# EAGLE design GyroCam BNO055_v2 (EAGLE 9.6.2)
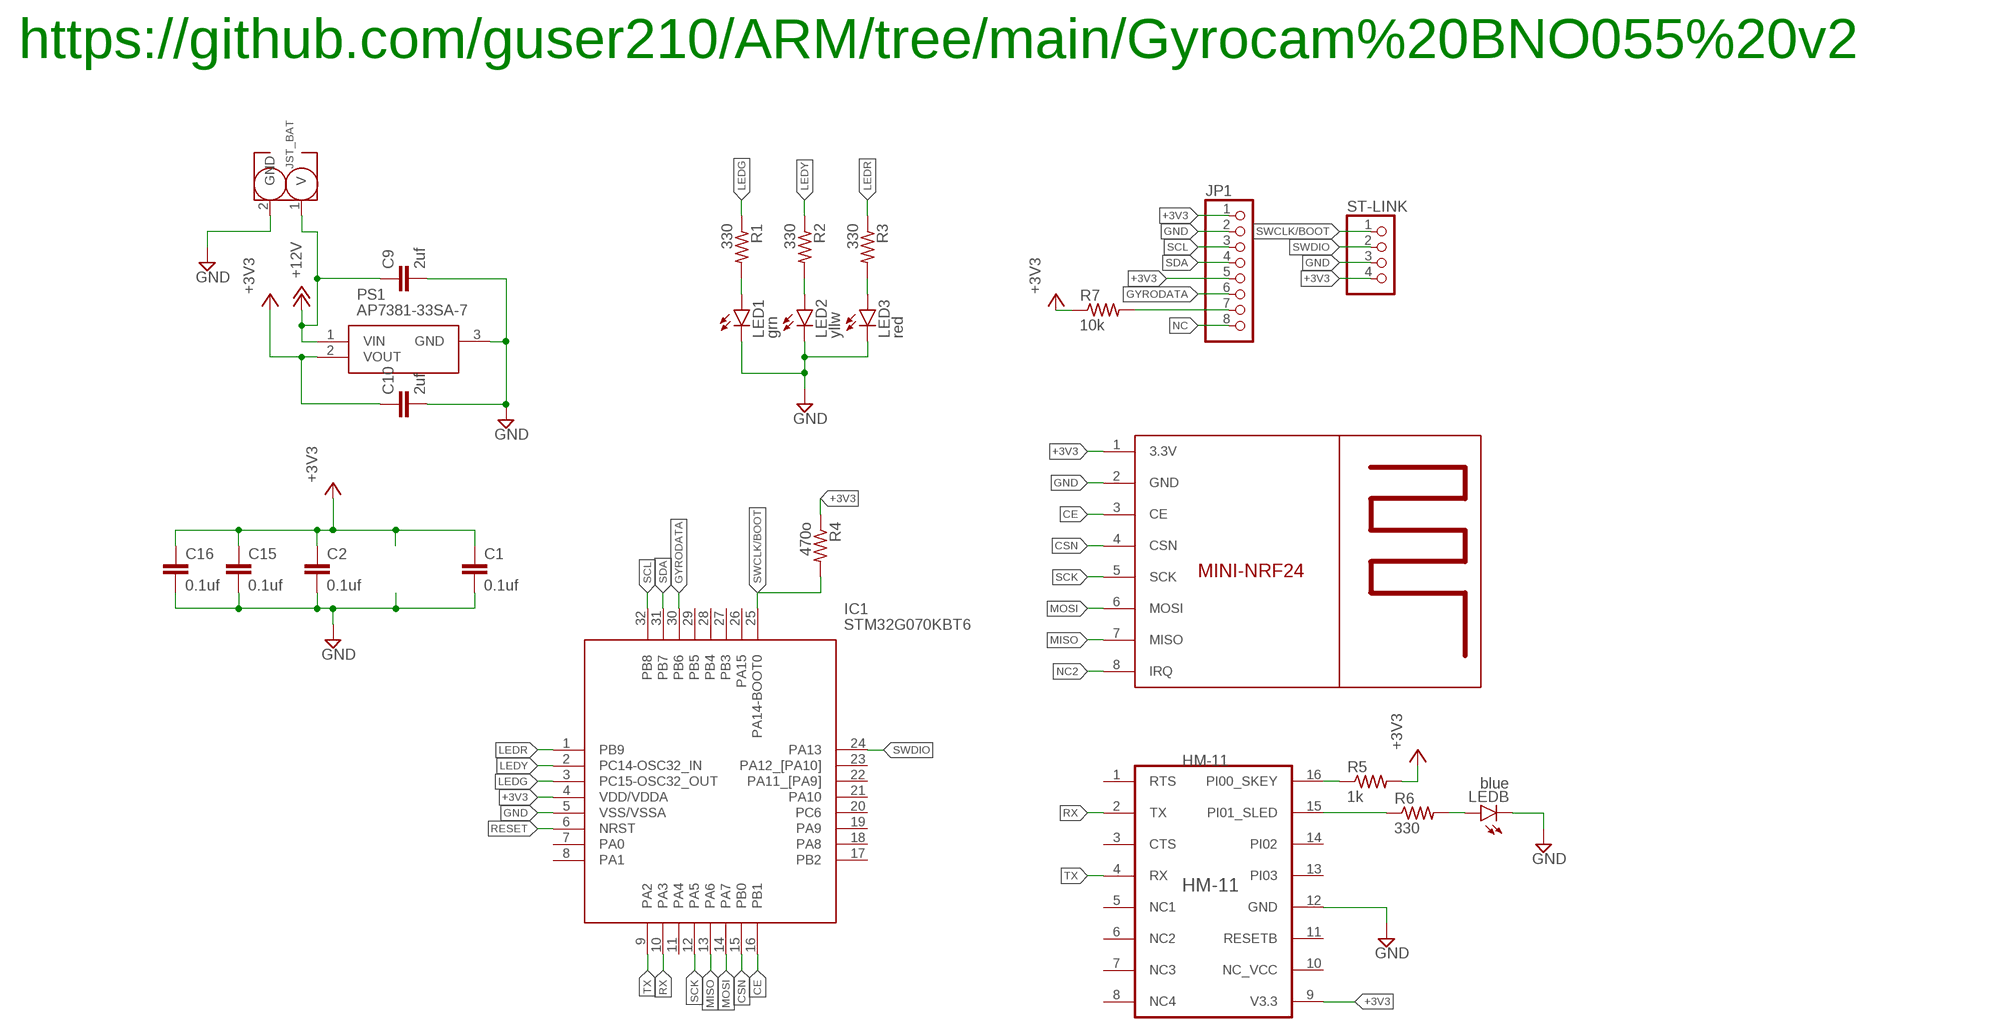
[diagram p0: schematic, sheet 1]

## Parts
C1  0.1uf  C-EUC0603K  [C0603K]
C2  0.1uf  C-EUC0805K  [C0805K]
C9  2uf  C-EUC0805K  [C0805K]
C10  2uf  C-EUC0805K  [C0805K]
C15  0.1uf  C-EUC0805K  [C0805K]
C16  0.1uf  C-EUC0805K  [C0805K]
IC1  STM32G070KBT6  [QFP80P900X900X160-32N]
JP1  PINHD-1X8  [1X08]
LED1  grn  LEDSML0805  [SML0805]
LED2  yllw  LEDSML0805  [SML0805]
LED3  red  LEDSML0805  [SML0805]
LEDB  blue  LEDSML0805  [SML0805]
PS1  AP7381-33SA-7  [SOT96P240X120-3N]
R1  330  R-US_M0805  [M0805]
R2  330  R-US_M0805  [M0805]
R3  330  R-US_M0805  [M0805]
R4  470o  R-US_M0805  [M0805]
R5  1k  R-US_M0805  [M0805]
R6  330  R-US_M0805  [M0805]
R7  10k  R-US_M0805  [M0805]
ST-LINK  PINHD-1X4  [1X04]
SUPP  JST2.0MM_2PIN  [JST2.0MM_2PIN]
U$1  HM-11  [HM-11]
U$3  NRF24  MINI-NRF24L01PSMD  [NRF24L01_SMD]

## Nets
+3V3: C1.1 C2.1 C10.1 C15.1 C16.1 IC1.4(VDD/VDDA) JP1.1 JP1.5 PS1.2(VOUT) R4.1 R5.2 R7.1 ST-LINK.4 U$1.9(V3.3) U$3.1(3.3V)
+12V: C9.1 PS1.1(VIN) SUPP.1(V)
BOOT: JP1.7 R7.2
CE: IC1.16(PB1) U$3.3(CE)
CSN: IC1.15(PB0) U$3.4(CSN)
GND: C1.2 C2.2 C9.2 C10.2 C15.2 C16.2 IC1.5(VSS/VSSA) JP1.2 LED1.C LED2.C LED3.C LEDB.C PS1.3(GND) ST-LINK.3 SUPP.2(GND) U$1.12(GND) U$3.2(GND)
GYRODATA: IC1.30(PB6) JP1.6
LEDG: IC1.3(PC15-OSC32_OUT) R1.1
LEDR: IC1.1(PB9) R3.1
LEDY: IC1.2(PC14-OSC32_IN) R2.1
MISO: IC1.13(PA6) U$3.7(MISO)
MOSI: IC1.14(PA7) U$3.6(MOSI)
N$2: LED2.A R2.2
N$3: LED1.A R1.2
N$4: LED3.A R3.2
N$5: R5.1 U$1.16(PI00_SKEY)
N$6: R6.1 U$1.15(PI01_SLED)
N$7: LEDB.A R6.2
NC: JP1.8
NC2: U$3.8(IRQ)
RESET: IC1.6(NRST)
RX: IC1.10(PA3) U$1.2(TX)
SCK: IC1.12(PA5) U$3.5(SCK)
SCL: IC1.32(PB8) JP1.3
SDA: IC1.31(PB7) JP1.4
SWCLK/BOOT: IC1.25(PA14-BOOT0) R4.2 ST-LINK.1
SWDIO: IC1.24(PA13) ST-LINK.2
TX: IC1.9(PA2) U$1.4(RX)
Unconnected: IC1.7(PA0) IC1.8(PA1) IC1.11(PA4) IC1.17(PB2) IC1.18(PA8) IC1.19(PA9) IC1.20(PC6) IC1.21(PA10) IC1.22(PA11_[PA9]) IC1.23(PA12_[PA10]) IC1.26(PA15) IC1.27(PB3) IC1.28(PB4) IC1.29(PB5) U$1.1(RTS) U$1.3(CTS) U$1.5(NC1) U$1.6(NC2) U$1.7(NC3) U$1.8(NC4) U$1.10(NC_VCC) U$1.11(RESETB) U$1.13(PI03) U$1.14(PI02)

## Notes on the sheet
- https://github.com/guser210/ARM/tree/main/Gyrocam%20BNO055%20v2

## Library data of the parts
C1 C2 C9 C10 C15 C16 = rcl:C-EU: CAPACITOR, European symbol; SPICEPREFIX: C
IC1 = STM32G070KBT6:STM32G070KBT6: 32-bit Microcontrollers - MCU Arm Cortex -M0+ 32-bit MCU, 128 KB Flash, 36 KB RAM, 4x USART, timers, ADC, comm. I/Fs, 2.0-3.6V Source: Datasheet; DESCRIPTION: 32-bit Microcontrollers - MCU Arm Cortex -M0+ 32-bit MCU, 128 KB Flash, 36 KB RAM, 4x USART, timers, ADC, comm. I/Fs, 2.0-3.6V; HEIGHT: 1.6mm; MANUFACTURER_NAME: STMicroelectronics; MANUFACTURER_PART_NUMBER: STM32G070KBT6; MOUSER_PART_NUMBER: 511-STM32G070KBT6; MOUSER_PRICE-STOCK: https://www.mouser.co.uk/ProductDetail/STMicroelectronics/STM32G070KBT6?qs=l7cgNqFNU1hmGcXjKEot4A%3D%3D
JP1 = pinhead:PINHD-1X8: PIN HEADER
LED1-LED3 LEDB = led:LED: LED OSRAM: - CHIPLED LG R971, LG N971, LY N971, LG Q971, LY Q971, LO R971, LY R971 LH N974, LH R974 LS Q976, LO Q976, LY Q976 LO Q996 - Hyper CHIPLED LW Q18S LB Q993, LB Q99A, LB R99A - SideLED LS A670, LO A670, LY A670, LG A670, LP A670 LB A673, LV A673, LT A673, LW A673 LH A674 LY A675 LS A676, LA A676, LO A676, LY A676, LW A676 LS A679, LY A679, LG A679 - Hyper Micro SIDELED® LS Y876, LA Y876, LO Y876, LY Y876 LT Y87S - SmartLED LW L88C, LW L88S LB L89C, LB L89S, LG L890 LS L89K, LO L89K, LY L89K LS L896, LA L896, LO L896, LY L896 - TOPLED LS T670, LO T670, LY T670, LG T670, LP T670 LSG T670, LSP T670, LSY T670, LOP T670, LYG T670 LG T671, LOG T671, LSG T671 LB T673, LV T673, LT T673, LW T673 LH T674 LS T676, LA T676, LO T676, LY T676, LB T676, LH T676, LSB T676, LW T676 LB T67C, LV T67C, LT T67C, LS T67K, LO T67K, LY T67K, LW E67C LS E67B, LA E67B, LO E67B, LY E67B, LB E67C, LV E67C, LT E67C LW T67C LS T679, LY T679, LG T679 LS T770, LO T770, LY T770, LG T770, LP T770 LB T773, LV T773, LT T773, LW T773 LH T774 LS E675, LA E675, LY E675, LS T675 LS T776, LA T776, LO T776, LY T776, LB T776 LHGB T686 LT T68C, LB T68C - Hyper Mini TOPLED® LB M676 - Mini TOPLED Santana® LG M470 LS M47K, LO M47K, LY M47K Source: http://www.osram.convergy.de LUXEON: - LUMILED® LXK2-PW12-R00, LXK2-PW12-S00, LXK2-PW14-U00, LXK2-PW14-V00 LXK2-PM12-R00, LXK2-PM12-S00, LXK2-PM14-U00 LXK2-PE12-Q00, LXK2-PE12-R00, LXK2-PE12-S00, LXK2-PE14-T00, LXK2-PE14-U00 LXK2-PB12-K00, LXK2-PB12-L00, LXK2-PB12-M00, LXK2-PB14-N00, LXK2-PB14-P00, LXK2-PB14-Q00 LXK2-PR12-L00, LXK2-PR12-M00, LXK2-PR14-Q00, LXK2-PR14-R00 LXK2-PD12-Q00, LXK2-PD12-R00, LXK2-PD12-S00 LXK2-PH12-R00, LXK2-PH12-S00 LXK2-PL12-P00, LXK2-PL12-Q00, LXK2-PL12-R00 Source: www.luxeon.com KINGBRIGHT: KA-3528ASYC Source: www.kingbright.com
PS1 = AP7381-33SA-7:AP7381-33SA-7: LDO CMOS LowCurr SOT23 T&R 3K Source: Datasheet <https://www.diodes.com/assets/Datasheets/AP7381.pdf>; DESCRIPTION: LDO CMOS LowCurr SOT23 T&R 3K; HEIGHT: 1.2mm; MANUFACTURER_NAME: Diodes Inc.; MANUFACTURER_PART_NUMBER: AP7381-33SA-7; MOUSER_PART_NUMBER: 621-AP7381-33SA-7; MOUSER_PRICE-STOCK: https://www.mouser.co.uk/ProductDetail/Diodes-Incorporated/AP7381-33SA-7?qs=y6ZabgHbY%252ByfboEZm%252BnPlA%3D%3D
R1-R7 = rcl:R-US_: RESISTOR, American symbol; SPICEPREFIX: R
ST-LINK = pinhead:PINHD-1X4: PIN HEADER
SUPP = Gil:JST2.0MM_2PIN
U$1 = Gil:HM-11
U$3 = Gil:MINI-NRF24L01P

## Board
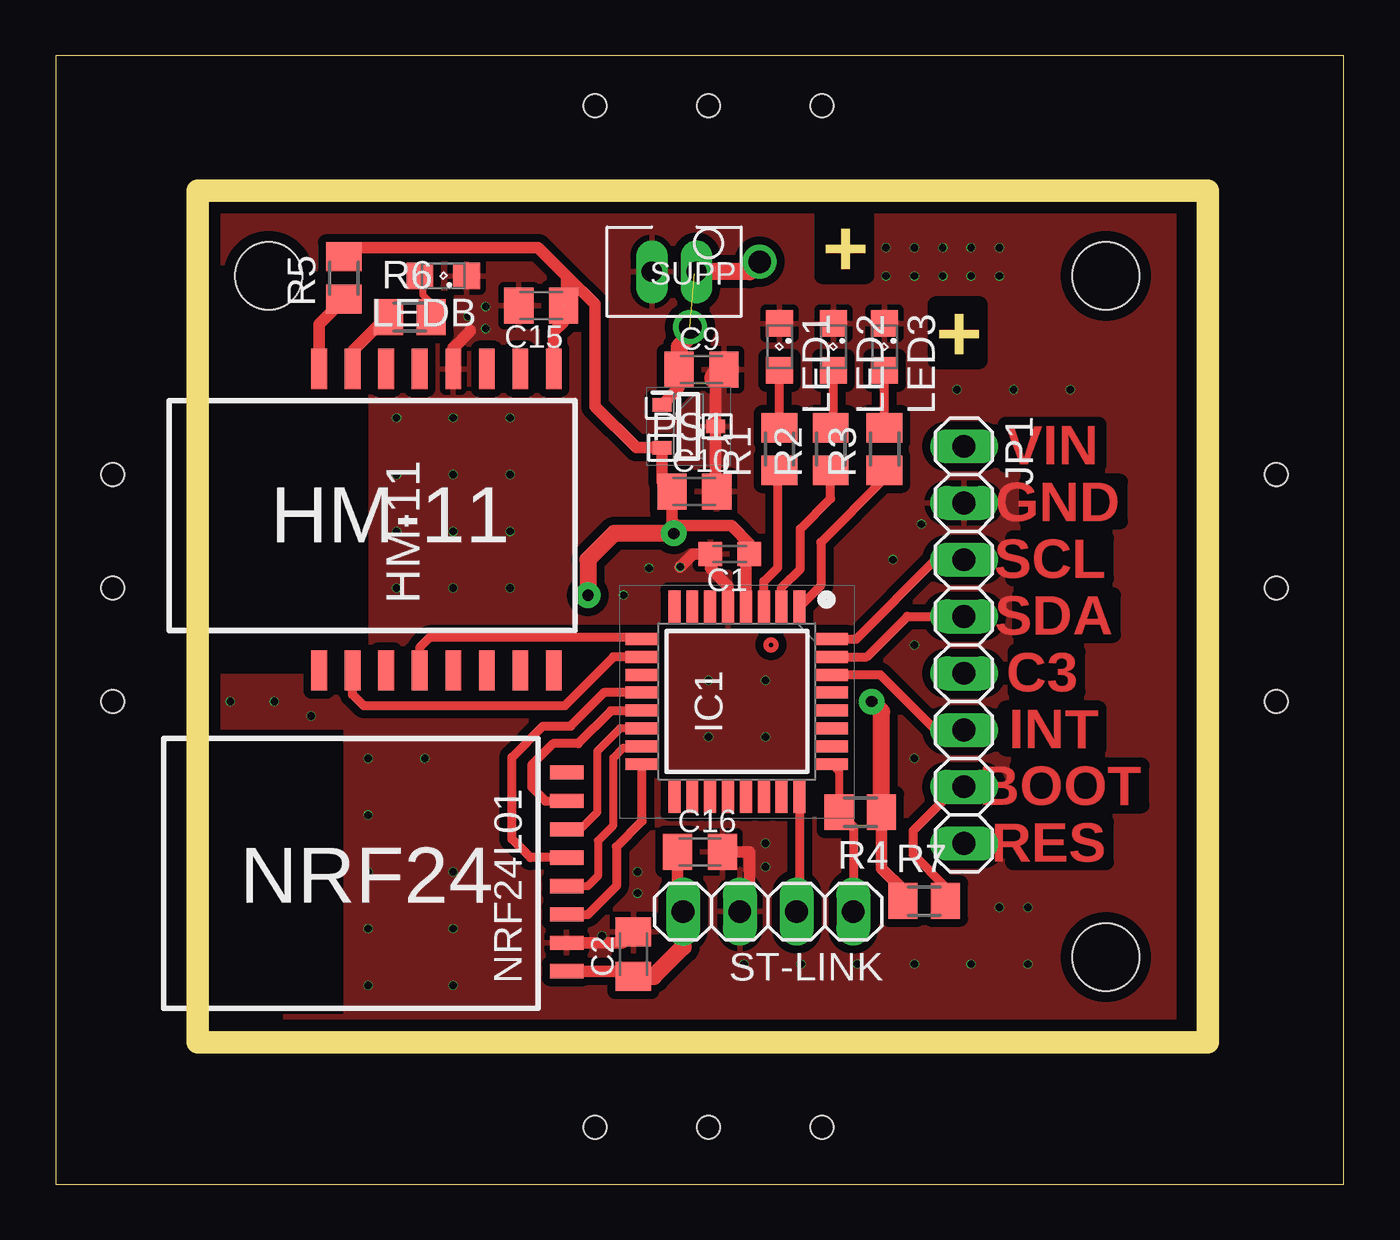
[diagram p1: board, top side]
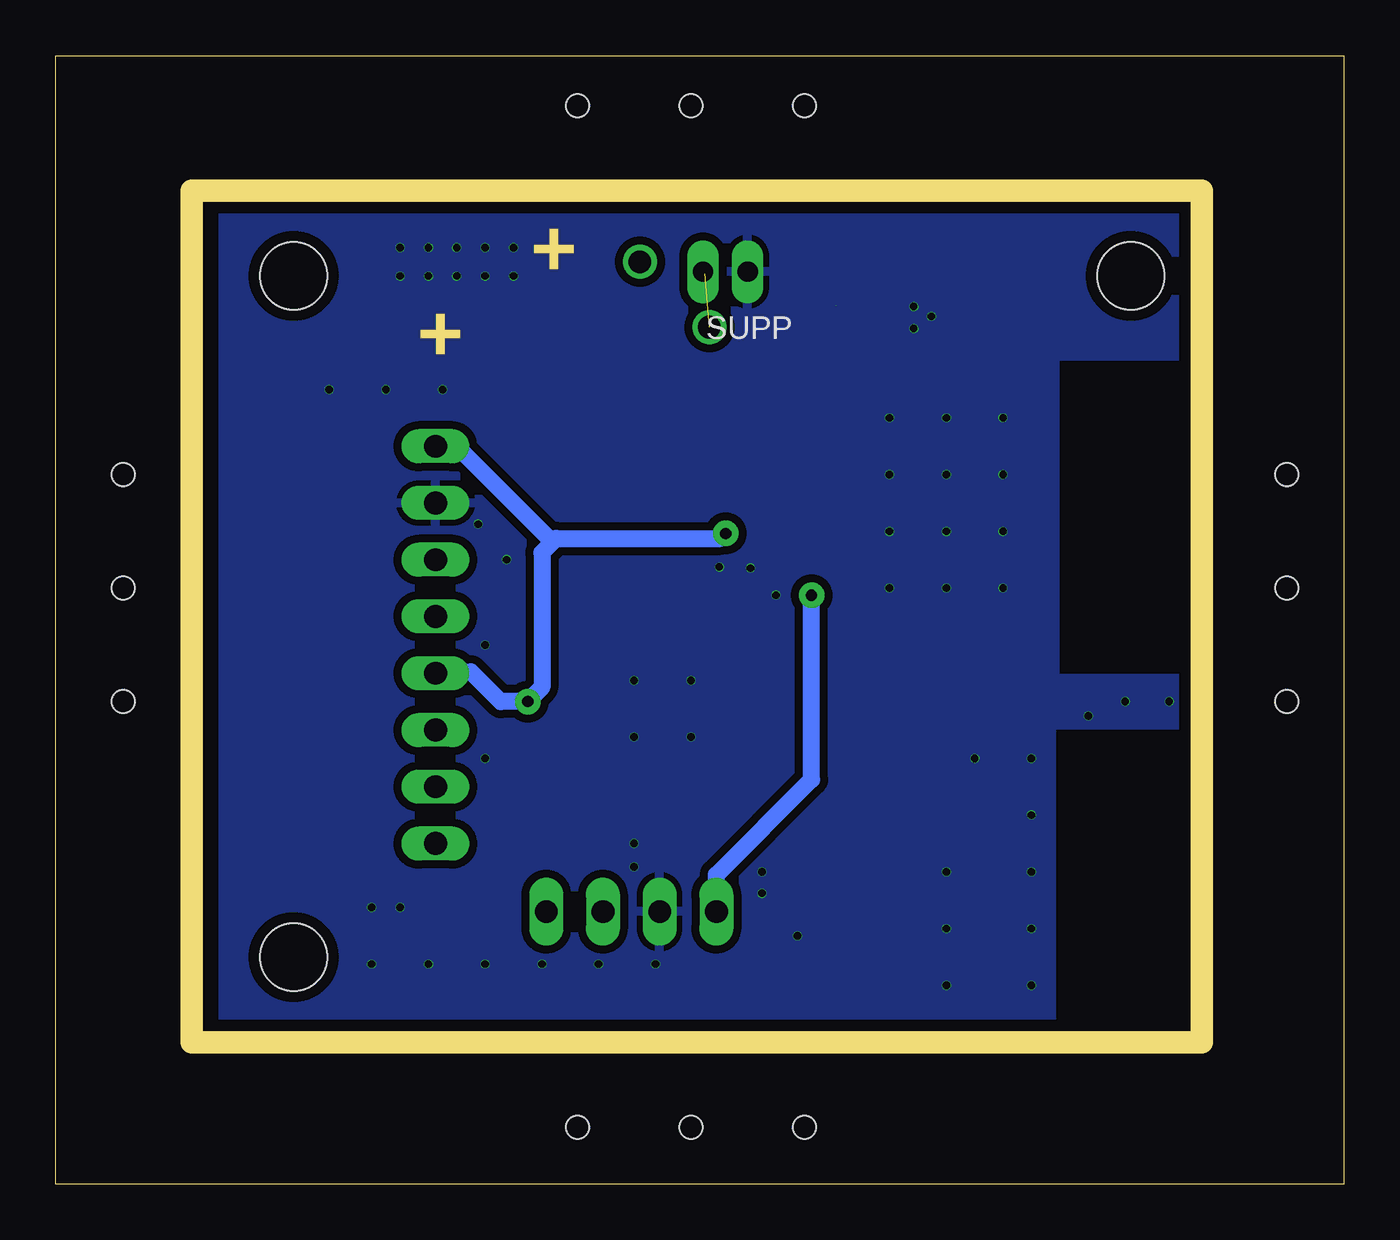
[diagram p2: board, bottom side, seen from below]

Size 57.63 x 50.49 mm. Coordinates in mm from the lower left corner, seen from the top.
Outline: 0,0 57.63,0 57.63,50.49 0,50.49 0,0
Outline: 6.35,44.45 51.56,44.45 51.56,6.35 6.35,6.35 6.35,44.45
Copper layers (1*16): Top 0.035mm / dielectric 1.5mm / Bottom 0.035mm
Design rules "default *": minimum track width 12mil, minimum drill 0.35mm, track to track 14mil, track to pad 14mil, pad to pad 14mil, via to via 12mil, smd to smd 14mil, copper to edge 20mil, drill to drill 6mil, minimum pad ring 10mil, minimum via ring 1mil, stop-mask expansion 4mil, vias tented up to drill 0mil, thermal gap 10mil
Holes 3 mm at 46.99,40.64 46.99,10.16 9.53,40.64
Holes 1.02 mm at 2.54,26.67 2.54,31.75 2.54,21.59 54.61,21.59 54.61,26.67 54.61,31.75 29.21,48.26 24.13,48.26 34.29,48.26 34.29,2.54 29.21,2.54 24.13,2.54
tRestrict: area 0,5.1 to 10.2,10.2; area 1.9,34.9 to 7,45.1
bRestrict: area 0,3.8 to 10.2,8.9; area 1.9,34.9 to 7,45.1
Milling: 4 lines

### Footprints (pad centres in the part's own frame; a part is rotated, then mirrored left to right if it is on the bottom)
C0603K = smd 1.05 x 1.08: 1 -0.875,0; 2 0.875,0
C0805K = smd 1.3 x 1.6: 1 -1,0; 2 1,0
QFP80P900X900X160-32N = smd 1.475 x 0.533: 1 -4.238,2.8; 2 -4.238,2; 3 -4.238,1.2; 4 -4.238,0.4; 5 -4.238,-0.4; 6 -4.238,-1.2; 7 -4.238,-2; 8 -4.238,-2.8; 17 4.238,-2.8; 18 4.238,-2; 19 4.238,-1.2; 20 4.238,-0.4; 21 4.238,0.4; 22 4.238,1.2; 23 4.238,2; 24 4.238,2.8 | smd 0.533 x 1.475: 9 -2.8,-4.238; 10 -2,-4.238; 11 -1.2,-4.238; 12 -0.4,-4.238; 13 0.4,-4.238; 14 1.2,-4.238; 15 2,-4.238; 16 2.8,-4.238; 25 2.8,4.238; 26 2,4.238; 27 1.2,4.238; 28 0.4,4.238; 29 -0.4,4.238; 30 -1.2,4.238; 31 -2,4.238; 32 -2.8,4.238
1X08 = drill 1.016 long: 1 -8.89,0; 2 -6.35,0; 3 -3.81,0; 4 -1.27,0; 5 1.27,0; 6 3.81,0; 7 6.35,0; 8 8.89,0
SML0805 = smd 1.2 x 1.2: A 1.05,0; C -1.05,0
SOT96P240X120-3N = smd 0.85 x 0.6: 1 -1.2,0.96; 2 -1.2,-0.96; 3 1.2,0
M0805 = smd 1.3 x 1.6: 1 -0.95,0; 2 0.95,0
1X04 = drill 1.016 long: 1 -3.81,0; 2 -1.27,0; 3 1.27,0; 4 3.81,0
JST2.0MM_2PIN = drill 0.9 pad 1.27 long: 1 0,2; 2 0,0
HM-11 = smd 1.8 x 0.7: 1 -7.5,6; 2 -7.5,4.5; 3 -7.5,3; 4 -7.5,1.5; 5 -7.5,0; 6 -7.5,-1.5; 7 -7.5,-3; 8 -7.5,-4.5; 9 6,-4.5; 10 6,-3; 11 6,-1.5; 12 6,0; 13 6,1.5; 14 6,3; 15 6,4.5; 16 6,6
NRF24L01_SMD = smd 1.5 x 0.635: 1 0,4.445; 2 0,3.175; 3 0,1.905; 4 0,0.635; 5 0,-0.635; 6 0,-1.905; 7 0,-3.175; 8 0,-4.445

### Placement (x,y rotation side)
C1  30.16,28.19 180 top
C2  25.84,10.29 90 top
C9  28.89,36.45 0 top
C10  28.57,30.99 0 top
C15  21.72,39.31 180 top
C16  28.83,14.86 0 top
IC1  30.48,21.59 270 top
JP1  40.64,24.13 270 top
LED1  32.38,37.47 270 top
LED2  34.8,37.47 270 top
LED3  37.08,37.47 270 top
LEDB  17.34,40.64 180 top
PS1  28.32,33.91 0 top
R1  32.38,32.89 90 top
R2  34.67,32.89 90 top
R3  37.08,32.89 90 top
R4  36,16.64 180 top
R5  12.89,40.54 90 top
R6  15.84,38.8 0 top
R7  38.86,12.67 0 top
ST-LINK  31.88,12.19 180 top
SUPP  26.67,40.83 270 top
U$1  17.78,30.48 90 top
U$3  22.86,13.97 180 top

### Tracks (layer width: path | path; a pad name or v marks a point on that pad's centre or on a via)
+3V3  (via drill 0.5 pad 1.14, 0.5 pad 1.15)  (1 unrouted)
  Top 0.305: R7.1 37.91,13.18
  Top 0.508: IC1.4 30.88,28.04 C1.1 31.07,28.22 31.07,28.62 30.23,29.46 27.81,29.46 27.57,29.7 C10.1 | C2.1 25.61,9.53 U$3.1 | C16.1 27.83,12.43 ST-LINK.4 | R5.2 13.31,41.91 21.59,41.91 22.86,40.64 | C10.1 27.12,31.44 PS1.2 25.98,32.95 24.13,34.8 24.13,39.37 22.86,40.64 | JP1.1 40.55,33.02 | C10.1 27.57,29.19 v27.65,29.11 | R4.1 36.95,14.13 37.91,13.18 | U$1.9 22.28,38.15 22.72,38.58 C15.1 22.86,39.45 22.86,40.64
  Top 0.762: R4.1 36.95,21.15 v36.51,21.59 | C2.1 26.75,9.29 28.07,10.6 ST-LINK.4 | v27.65,29.11 24.99,29.11 23.81,27.94 v23.81,26.35
  Bottom 0.762: 35.24,28.89 35.56,28.89 39.69,33.02 JP1.1 | 35.24,28.89 27.88,28.89 v27.65,29.11 | 35.24,28.89 35.88,28.26 35.88,22.23 v36.51,21.59 37.72,21.59 39.05,22.92 40.58,22.92 JP1.5 | ST-LINK.4 28.07,13.84 23.81,18.1 v23.81,26.35
+12V  (via drill 1.02 pad 1.52)  (1 unrouted)
  Top 0.508: C9.1 27.89,35.64 PS1.1
  Top 0.762: 28.59,40.75 SUPP.1 31.05,40.83 v31.5,41.27 | C9.1 27.89,37.47 28.38,37.96 v28.38,38.35
BOOT
  Top 0.305: R7.2 39.81,13.3 | 40.32,17.78 JP1.7
  Top 0.406: 39.81,13.3 38.37,14.75 38.37,15.82 40.32,17.78
CE
  Top 0.406: U$3.3 23.81,12.06 25.08,13.34 25.08,15.09 26.24,16.25 IC1.16
CSN
  Top 0.305: 26.17,19.52 IC1.15
  Top 0.356: U$3.4 23.81,13.34 24.26,13.78 24.26,15.37 24.95,16.06 24.95,19.08 25.39,19.52 26.17,19.52
GND  (via drill 0.35)
  Top 0.508: IC1.5 30.08,26.77 29.29,27.56 C1.2 28.51,28.19 v27.94,27.62 | C10.2 29.52,31.04 PS1.3 29.52,36.08 | U$3.2 25.35,10.79 C2.2 | 18.54,38.23 18.54,38.16 17.8,37.42 17.78,37.43 U$1.12 | C16.2 31.05,14.86 31.05,12.64 ST-LINK.3
  Top 1.016: C9.2 29.52,36.08
  other vias: 15.24,34.29 31.75,15.24 13.97,19.05 13.97,16.51 13.97,13.97 13.97,11.43 7.81,21.59 11.43,20.95 29.21,22.54 29.21,20 31.75,22.54 31.75,20 15.24,31.75 15.24,29.21 15.24,26.67 37.15,41.91 37.15,40.64 40.32,35.56 38.73,29.53 42.86,35.56 38.42,9.84 40.96,9.84 43.5,9.84 42.23,12.38 43.5,12.38 17.78,34.29 17.78,31.75 17.78,29.21 17.78,26.67 19.24,39.27 19.24,38.29 20.32,34.29 20.32,31.75 20.32,29.21 20.32,26.67 37.47,27.94 45.4,35.56 38.42,19.05 17.78,8.89 17.78,11.43 17.78,13.97 13.97,8.89 16.51,19.05 31.75,14.19 38.42,24.13 38.42,40.64 38.42,41.91 26.54,27.56 25.4,26.35 26.04,13.02 26.04,13.97 35.88,9.84 33.34,9.84 30.8,9.84 18.45,38.83 9.78,21.59 24.45,11.11 40.96,40.64 40.96,41.91 42.23,40.64 42.23,41.91 39.69,40.64 39.69,41.91
  pour Bottom: 6.67,44.07 50.16,44.07 50.16,6.99 6.67,6.99
  pour Top: 50.04,6.99 50.04,44.13 6.35,44.13 6.35,6.99
GYRODATA
  Top 0.305: 39.37,20.32 JP1.6
  Top 0.406: 39.37,20.32 36.9,22.79 IC1.30
LEDG
  Top 0.305: 32.31,31.87 R1.1
  Top 0.406: IC1.3 31.68,26.97 32.31,27.6 32.31,31.87
LEDR
  Top 0.305: 37.08,31.56 R3.1
  Top 0.406: IC1.1 34.23,26.78 34.23,28.71 37.08,31.56
LEDY
  Top 0.406: IC1.2 32.48,26.69 33.31,27.53 33.31,29.32 34.67,30.67 R2.1
MISO
  Top 0.305: IC1.13 26.23,21.18
  Top 0.406: U$3.7 21.91,17.14 21.29,17.76 21.29,18.75 22.25,19.71 23.38,19.71 24.84,21.18 26.23,21.18
MOSI
  Top 0.305: 23.46,15.88 U$3.6
  Top 0.356: 23.46,15.88 24.22,16.64 24.22,19.37 25.24,20.39 IC1.14
N$2
  Top 0.305: R2.2 34.8,33.97
  Top 0.406: 34.8,33.97 LED2.A
N$3
  Top 0.406: R1.2 LED1.A
N$4
  Top 0.406: R3.2 LED3.A
N$5
  Top 0.508: U$1.16 11.78,38.48 R5.1
N$6
  Top 0.508: R6.1 14.8,38.8 13.28,37.28 U$1.15
N$7
  Top 0.305: LEDB.A 16.41,40.51 16.41,39.81 16.79,39.43 R6.2
RX
  Top 0.406: IC1.10 24.95,23.59 22.77,21.4 13.79,21.4 13.28,21.91 U$1.2
SCK
  Top 0.305: U$3.5 22.85,14.62
  Top 0.406: 22.85,14.62 21.23,14.62 20.41,15.44 20.41,19.1 21.8,20.5 23.04,20.5 24.53,21.99 IC1.12
SCL
  Top 0.305: 39.37,27.94 JP1.3
  Top 0.406: IC1.32 35.82,24.39 39.37,27.94
SDA
  Top 0.406: IC1.31 36.29,23.59 38.1,25.4 JP1.4
SWCLK/BOOT
  Top 0.356: IC1.25 35.05,18.45 R4.2
  Top 0.406: R4.2 35.69,16 ST-LINK.1
SWDIO
  Top 0.305: 33.28,12.32 ST-LINK.2
  Top 0.406: IC1.24 33.28,12.32
TX
  Top 0.406: IC1.9 26.18,24.45 16.72,24.45 16.28,24.01 U$1.4
(copper drawn outside any net)
  shapes: Top circle x1

### Text on the board
Top: + | + | VIN | GND | SCL | SDA | C3 | INT | BOOT | RES
Dimension: + | +